# Altium schematic sheet WiFi.SchDoc
size A3; PageSetup: Record=PageOptions|CenterHorizontal=True|CenterVertical=True|PrintScale=0.97|XCorrection=1.00|YCorrection=1.00|PrintKind=0|BorderSize=5000000|LeftOffset=0|BottomOffset=0|Orientation=2|PaperLength=1000|PaperWidth=1000|Scale=100|PaperSource=7|PrintQuality=-4|MediaType=1|DitherType=10|PaperKind=A3 297x420mm|PrintScaleMode=1; Organization: Electronic Research & Design; Address1: 11 Granofier; Address2: Zwartkop; Address3: Centurion; Address4: South Africa
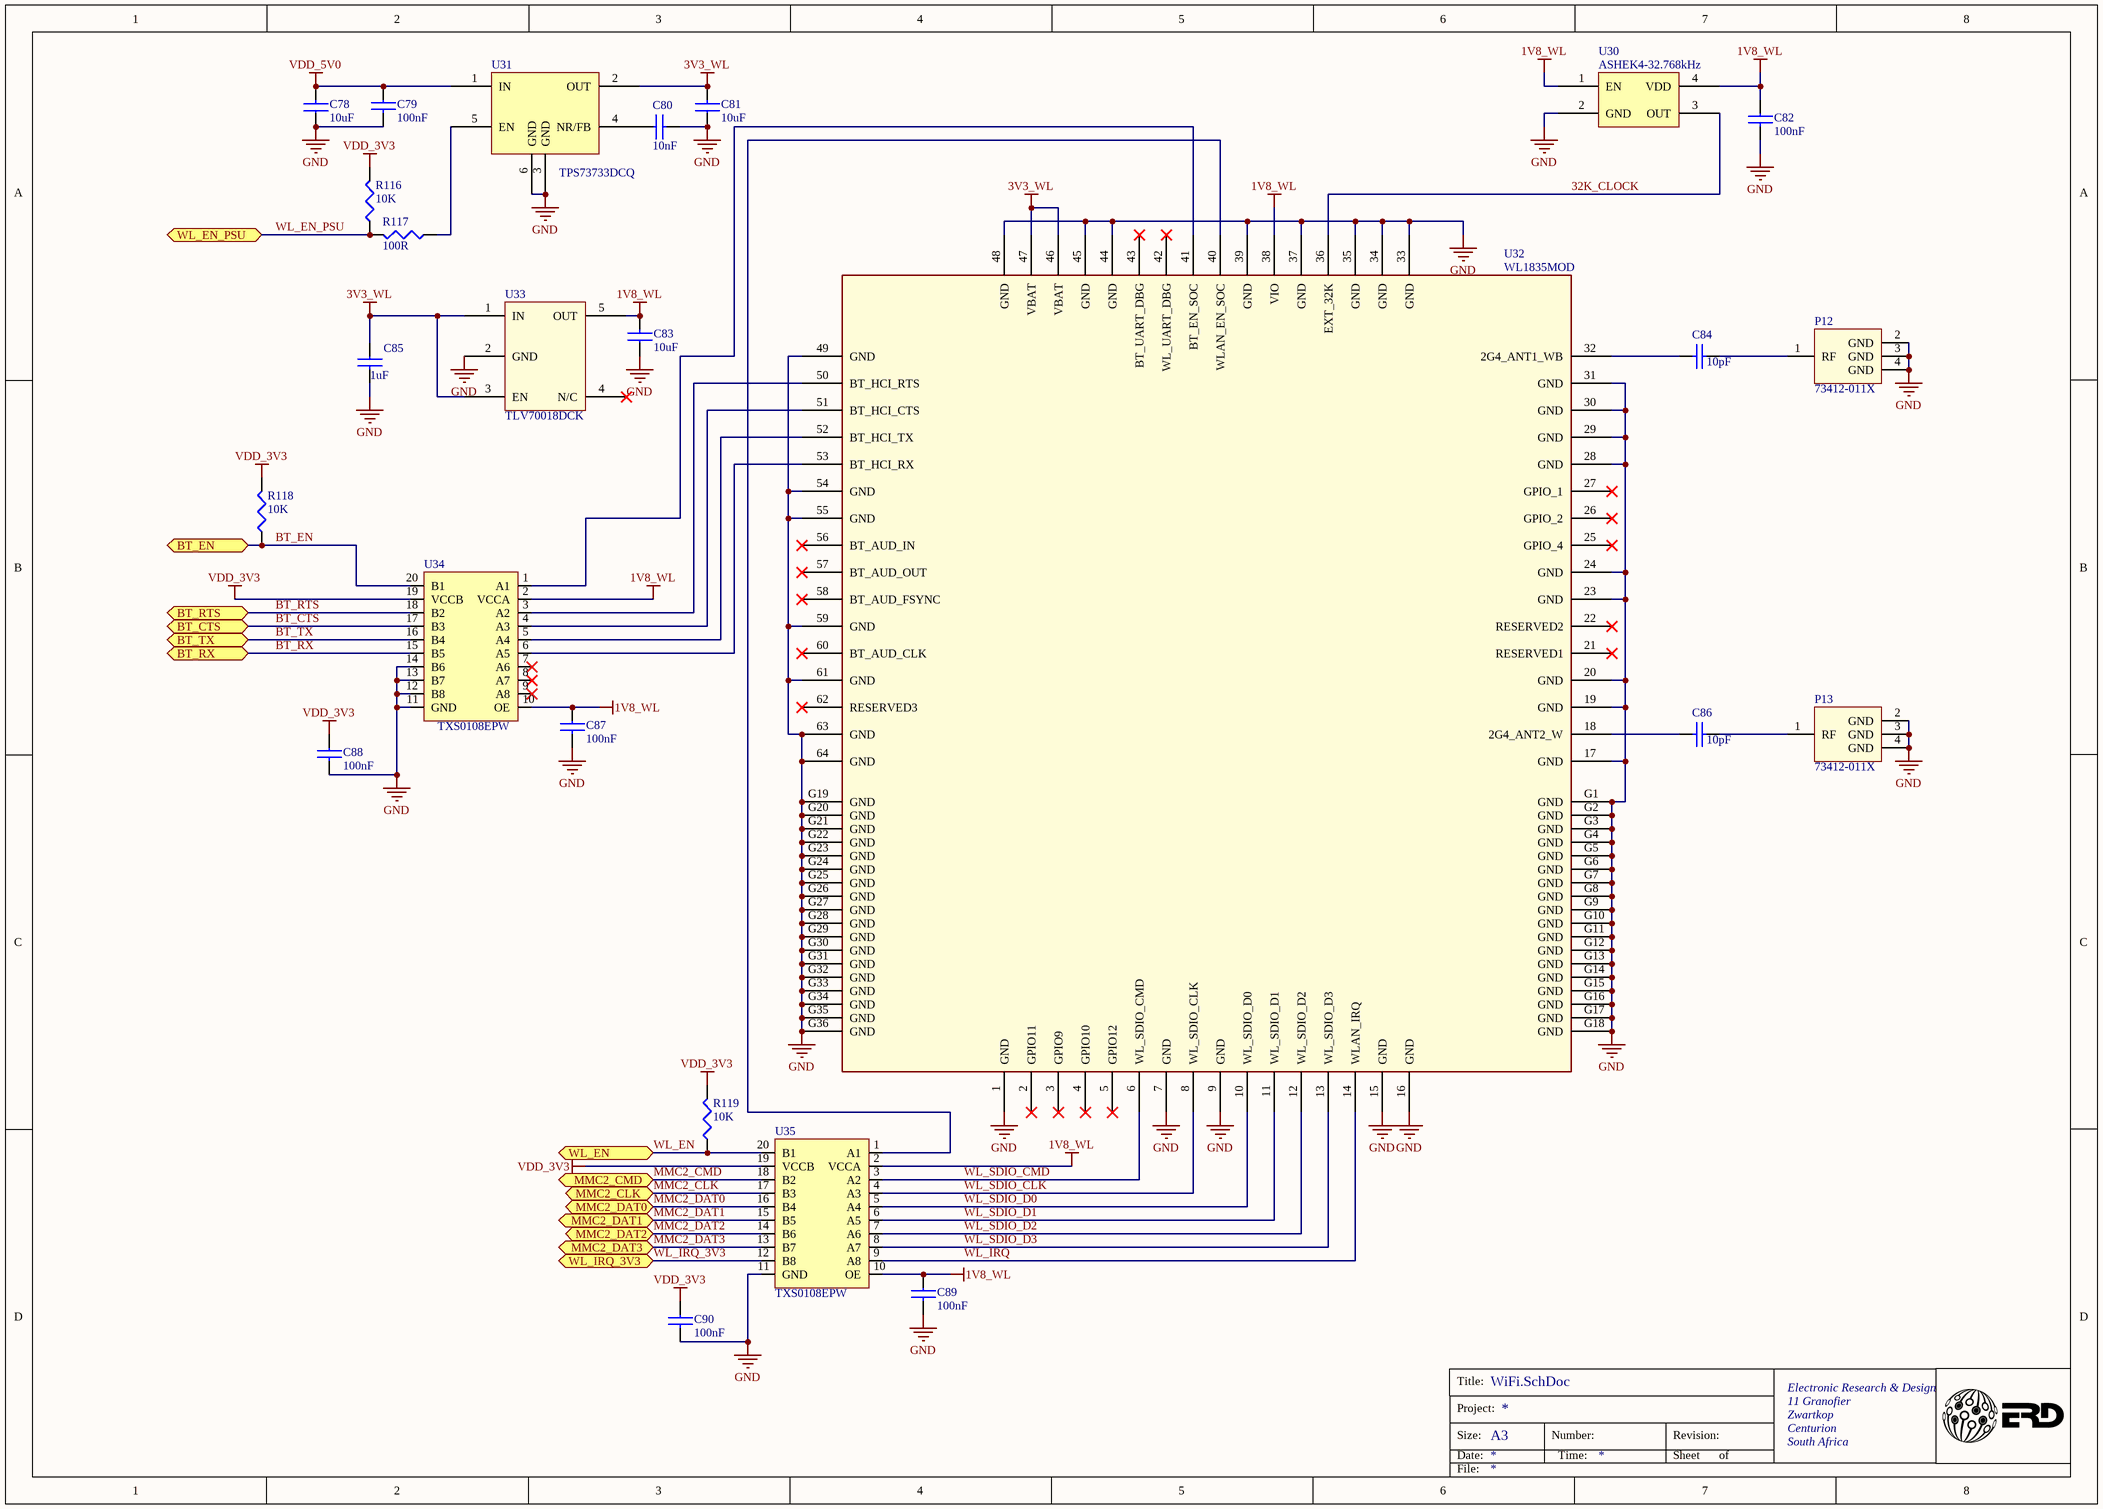
[diagram p0: WiFi.SchDoc]

## Parts
C78  10uF  [CC0603]
C79  100nF  [CC0402]
C80  10nF  [CC0402]
C81  10uF  [CC0603]
C82  100nF  [CC0402]
C83  10uF  [CC0603]
C84  10pF  [CC0402]
C85  1uF  [CC0402]
C86  10pF  [CC0402]
C87  100nF  [CC0402]
C88  100nF  [CC0402]
C89  100nF  [CC0402]
C90  100nF  [CC0402]
P12  73412-011X  [73412-011X]
P13  73412-011X  [73412-011X]
R116  10K  [RC0402]
R117  100R  [RC0402]
R118  10K  [RC0402]
R119  10K  [RC0402]
U30  ASHEK4-32.768kHz  [SMD3.2X2.5]
U31  TPS73733DCQ  [TPS73733DCQ]
U32  WL1835MOD  [E-13.4X13.3-N100_0.75-TOP]
U33  TLV70018DCK  [SC-70-5]
U34  TXS0108EPW  [TXB0108_PW_R]
U35  TXS0108EPW  [TXB0108_PW_R]

## Ports
BT_CTS, BT_EN, BT_RTS, BT_RX, BT_TX, MMC2_CLK, MMC2_CMD, MMC2_DAT0, MMC2_DAT1, MMC2_DAT2, MMC2_DAT3, WL_EN, WL_EN_PSU, WL_IRQ_3V3

## Nets
1V8_WL: C82.1 C83.2 C87.1 C89.1 U30.1(EN) U30.4(VDD) U32.38(VIO) U33.5(OUT) U34.2(VCCA) U34.10(OE) U35.2(VCCA) U35.10(OE)
3V3_WL: C81.2 C85.1 U31.2(OUT) U32.46(VBAT) U32.47(VBAT) U33.1(IN) U33.3(EN)
GND: C78.1 C79.2 C80.2 C81.1 C82.2 C83.1 C85.2 C87.2 C88.2 C89.2 C90.2 P12.2(GND) P12.3(GND) P12.4(GND) P13.2(GND) P13.3(GND) P13.4(GND) U30.2(GND) U31.3(GND) U31.6(GND) U32.1(GND) U32.7(GND) U32.9(GND) U32.15(GND) U32.16(GND) U32.17(GND) U32.19(GND) U32.20(GND) U32.23(GND) U32.24(GND) U32.28(GND) U32.29(GND) U32.30(GND) U32.31(GND) U32.33(GND) U32.34(GND) U32.35(GND) U32.37(GND) U32.39(GND) U32.44(GND) U32.45(GND) U32.48(GND) U32.49(GND) U32.54(GND) U32.55(GND) U32.59(GND) U32.61(GND) U32.63(GND) U32.64(GND) U32.G1(GND) U32.G2(GND) U32.G3(GND) U32.G4(GND) U32.G5(GND) U32.G6(GND) U32.G7(GND) U32.G8(GND) U32.G9(GND) U32.G10(GND) U32.G11(GND) U32.G12(GND) U32.G13(GND) U32.G14(GND) U32.G15(GND) U32.G16(GND) U32.G17(GND) U32.G18(GND) U32.G19(GND) U32.G20(GND) U32.G21(GND) U32.G22(GND) U32.G23(GND) U32.G24(GND) U32.G25(GND) U32.G26(GND) U32.G27(GND) U32.G28(GND) U32.G29(GND) U32.G30(GND) U32.G31(GND) U32.G32(GND) U32.G33(GND) U32.G34(GND) U32.G35(GND) U32.G36(GND) U33.2(GND) U34.11(GND) U34.12(B8) U34.13(B7) U34.14(B6) U35.11(GND)
VDD_3V3: C88.1 C90.1 R116.2 R118.2 R119.2 U34.19(VCCB) U35.19(VCCB)
VDD_5V0: C78.2 C79.1 U31.1(IN)
32K_CLOCK: U30.3(OUT) U32.36(EXT_32K)
BT_CTS: U34.17(B3) ; port BT_CTS
BT_EN: R118.1 U34.20(B1) ; port BT_EN
BT_RTS: U34.18(B2) ; port BT_RTS
BT_RX: U34.15(B5) ; port BT_RX
BT_TX: U34.16(B4) ; port BT_TX
MMC2_CLK: U35.17(B3) ; port MMC2_CLK
MMC2_CMD: U35.18(B2) ; port MMC2_CMD
MMC2_DAT0: U35.16(B4) ; port MMC2_DAT0
MMC2_DAT1: U35.15(B5) ; port MMC2_DAT1
MMC2_DAT2: U35.14(B6) ; port MMC2_DAT2
MMC2_DAT3: U35.13(B7) ; port MMC2_DAT3
WL_EN: R119.1 U35.20(B1) ; port WL_EN
WL_EN_PSU: R116.1 R117.2 ; port WL_EN_PSU
WL_IRQ: U32.14(WLAN_IRQ) U35.9(A8)
WL_IRQ_3V3: U35.12(B8) ; port WL_IRQ_3V3
WL_SDIO_CLK: U32.8(WL_SDIO_CLK) U35.4(A3)
WL_SDIO_CMD: U32.6(WL_SDIO_CMD) U35.3(A2)
WL_SDIO_D0: U32.10(WL_SDIO_D0) U35.5(A4)
WL_SDIO_D1: U32.11(WL_SDIO_D1) U35.6(A5)
WL_SDIO_D2: U32.12(WL_SDIO_D2) U35.7(A6)
WL_SDIO_D3: U32.13(WL_SDIO_D3) U35.8(A7)
NetC80_1: C80.1 U31.4(NR/FB)
NetC84_1: C84.1 P12.1(RF)
NetC84_2: C84.2 U32.32(2G4_ANT1_WB)
NetC86_1: C86.1 P13.1(RF)
NetC86_2: C86.2 U32.18(2G4_ANT2_W)
NetR117_1: R117.1 U31.5(EN)
NetU32_40: U32.40(WLAN_EN_SOC) U35.1(A1)
NetU32_41: U32.41(BT_EN_SOC) U34.1(A1)
NetU32_50: U32.50(BT_HCI_RTS) U34.3(A2)
NetU32_51: U32.51(BT_HCI_CTS) U34.4(A3)
NetU32_52: U32.52(BT_HCI_TX) U34.5(A4)
NetU32_53: U32.53(BT_HCI_RX) U34.6(A5)

Not connected (* = marked no-connect by the designer): U32 2(GPIO11)* 3(GPIO9)* 4(GPIO10)* 5(GPIO12)* 21(RESERVED1)* 22(RESERVED2)* 25(GPIO_4)* 26(GPIO_2)* 27(GPIO_1)* 42(WL_UART_DBG)* 43(BT_UART_DBG)* 56(BT_AUD_IN)* 57(BT_AUD_OUT)* 58(BT_AUD_FSYNC)* 60(BT_AUD_CLK)* 62(RESERVED3)*; U33 4(N/C)*; U34 7(A6)* 8(A7)* 9(A8)*

## Notes on the sheet
- Title:
- Size:
- Date:
- Project:
- A3
- Number:
- Time:
- Revision:
- Sheet
- of
- File:

## Library data of the parts
C78 C81 C83 = CAP CER 0.1UF 10V 10% X5R 0402: CAP CER 10UF 25V 20% X5R 0603; Manufacturer: Murata; PartNumber: GRM188R61E106MA73D; Package / Case: 0603; Supplier: AAD
C79 C82 C87-C90 = CAP CER 0.1UF 10V 10% X5R 0402: CAP CER 0.1UF 50V 10% X7R 0402; Manufacturer: Murata; PartNumber: GCM155R71H104KE02D; Package / Case: 0402 (1005 Metric); Supplier: AAD
C80 = CAP CER 0.1UF 10V 10% X5R 0402: CAP CER 10NF 50V 10% X7R 0402; Manufacturer: Murata; Part Number: GRM155R71H103KA88J; Package / Case: 0402; Voltage Rating: 50V
C84 C86 = CAPCERAMIC: 10pF/16V/X7R; Text Field1: Yageo; Text Field2: Phillips; Tolerance: ±20%; Dielectric: X7R; Voltage: 25V; Comment_1: 100n; Current: *; Wattage: *; Part Number: *
C85 = CAP CER 0.1UF 10V 10% X5R 0402: CAP CER 1UF 10V 20% X5R 0402; Manufacturer: Murata; Part Number: GRM153R61A105ME95D; Package / Case: 0402 (1005 Metric); Supplier: AAD
P12 P13 = 73412-011X: Molex U.FL SMD Receptacle
R116 R118 R119 = RES_10K_1/16W_1%_0402: RES, 10K OHM, 1/16W, 1%, 0402; Manufacturer: Yageo; Part Number: RC0402FR-0710KL; Package / Case: 0402 (1005 Metric); Supplier: AAD
R117 = RES_10K_1/16W_1%_0402: RES, 100 OHM, 1/16W, 1%, 0402; Manufacturer: Yageo; Part Number: RC0402FR-07100RL; Package / Case: 0402 (1005 Metric); Supplier: AAD
U30 = ASHEK4-32.768kHz: 32.768kHz SMD OSCILLATOR
U32 = WG7835-T0B module_ref_130904
U33 = TLV700: 200mA LOW DROPOUT REGULATOR
U34 U35 = TXB0108PW